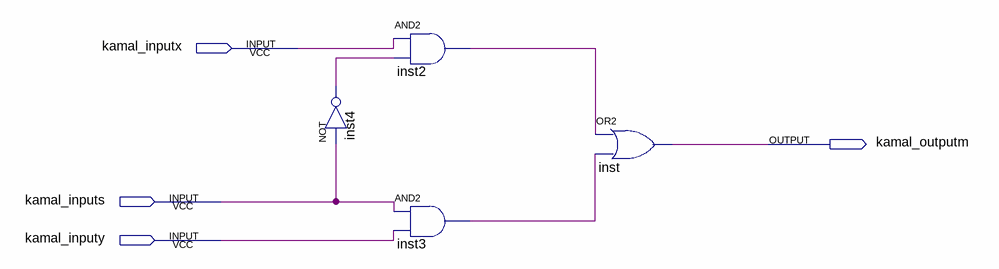
[diagram p0: schematic sheet]
// Quartus schematic kamal_mux2to1.bdf as structural Verilog: 4 symbols, 4 pins
module kamal_mux2to1 (
  input  kamal_inputx,
  input  kamal_inputs,
  input  kamal_inputy,
  output kamal_outputm
);

  wire inst2_out, inst3_out, inst4_out;

  not inst4 (inst4_out, kamal_inputs);
  and inst2 (inst2_out, kamal_inputx, inst4_out);
  and inst3 (inst3_out, kamal_inputs, kamal_inputy);
  or inst (kamal_outputm, inst2_out, inst3_out);
endmodule
